# Altium schematic sheet usb to uart.SchDoc
size A4
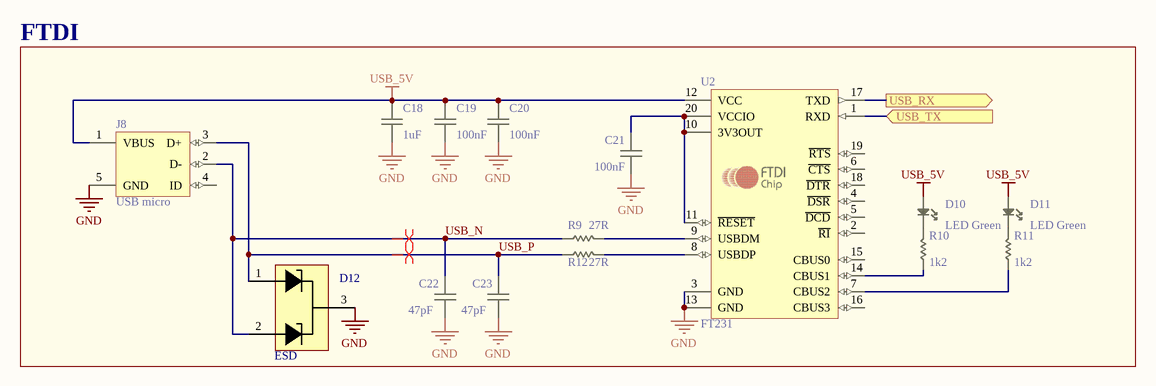
[diagram p0: usb to uart.SchDoc]

## Parts
C18  value 1uF  [C0603]  (hidden comment: Capacitor 0603)
C19  value 100nF  [C0603]  (hidden comment: Capacitor 0603)
C20  value 100nF  [C0603]  (hidden comment: Capacitor 0603)
C21  value 100nF  [C0603]  (hidden comment: Capacitor 0603)
C22  value 47pF  [C0603]  (hidden comment: Capacitor 0603)
C23  value 47pF  [C0603]  (hidden comment: Capacitor 0603)
D10  LED Green  [L0603 GREEN]
D11  LED Green  [L0603 GREEN]
D12  ESD  [ESD protection]
J8  USB micro  [USB micro]
R9  value 27R  [R0603]  (hidden comment: Resistor 0603)
R10  value 1k2  [R0603]  (hidden comment: Resistor 0603)
R11  value 1k2  [R0603]  (hidden comment: Resistor 0603)
R12  value 27R  [R0603]  (hidden comment: Resistor 0603)
U2  FT231  [FTDI]

## Blocks framed on the sheet
FTDI: C18-C23 D10-D12 J8 R9-R12 U2

## Ports
USB_RX (out), USB_TX (in)

## Nets
GND: C18.1 C19.1 C20.1 C21.1 C22.1 C23.1 D12.3 J8.5(GND) U2.3(GND) U2.13(GND)
USB_5V: C18.2 C19.2 C20.2 D10.1 D11.1 J8.1(VBUS) U2.12(VCC)
USB_N: C22.2 D12.2 J8.2(D-) R9.1
USB_P: C23.2 D12.1 J8.3(D+) R12.1
USB_RX: U2.17(TXD) ; port USB_RX
USB_TX: U2.1(RXD) ; port USB_TX
NetC21_2: C21.2 U2.10(3V3OUT) U2.11(~{RESET}) U2.20(VCCIO)
NetD10_2: D10.2 R10.2
NetD11_2: D11.2 R11.2
NetR9_2: R9.2 U2.9(USBDM)
NetR10_1: R10.1 U2.14(CBUS1)
NetR11_1: R11.1 U2.7(CBUS2)
NetR12_2: R12.2 U2.8(USBDP)

Not connected (* = marked no-connect by the designer): J8 4(ID); U2 2(~{RI}) 4(~{DSR}) 5(~{DCD}) 6(~{CTS}) 15(CBUS0) 16(CBUS3) 18(~{DTR}) 19(~{RTS})

## Layout directives
differential pair: USB_N, USB_P

## Library data of the parts
D10 D11 = LED 0603 Green
D12 = ESD protection 3.3V: PESD3V3S2UAT
U2 = FTDI: USB to UART